# Altium schematic sheet MCU.SchDoc
size A4; SheetNumber: 2; SheetTotal: 14
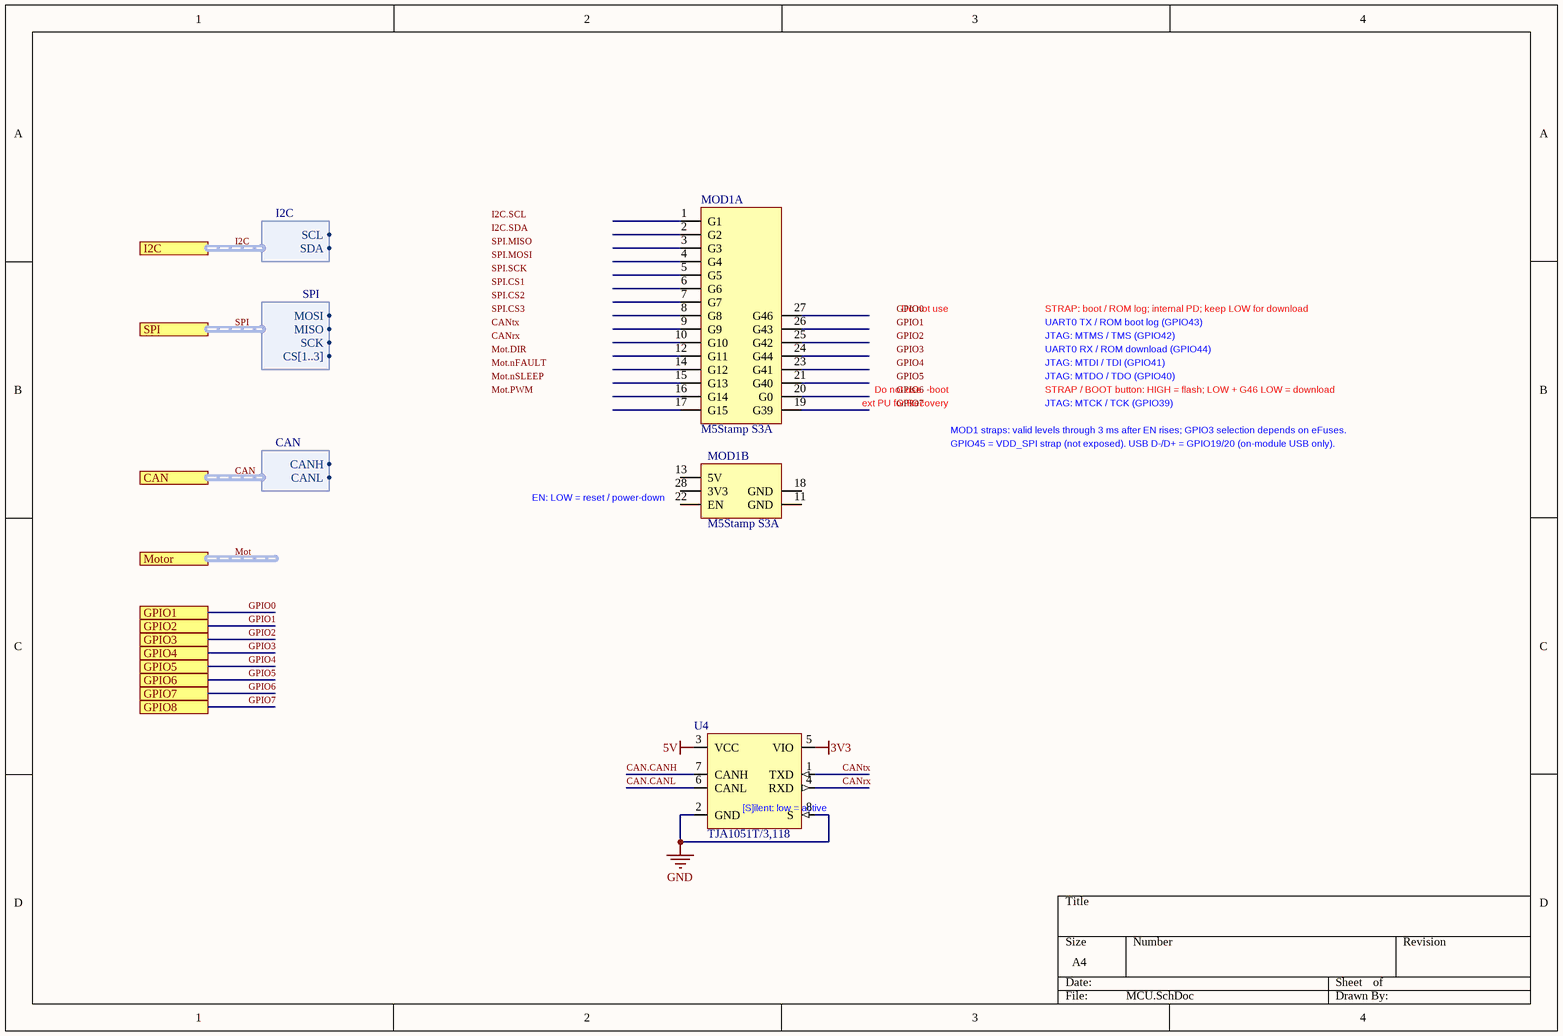
[diagram p0: MCU.SchDoc]

## Parts
MOD1  M5Stamp S3A  [M5Stamp S3A-mfg]  (parts A,B of 2)
U4  TJA1051T/3,118  [NXP-SOIC-8_L]

## Ports
CAN (harness CAN), GPIO1, GPIO2, GPIO3, GPIO4, GPIO5, GPIO6, GPIO7, GPIO8, I2C (harness I2C), Motor (harness MotCtrl), SPI (harness SPI)

## Harnesses
SPI: MOSI, MISO, SCK, CS[1..3]
CAN: CANH, CANL
I2C: SCL, SDA

## Nets
3V3: U4.5(VIO)
5V: U4.3(VCC)
GND: U4.2(GND) U4.8(S)
CAN.CANH: U4.7(CANH)
CAN.CANL: U4.6(CANL)
CANrx: U4.4(RXD)
CANtx: U4.1(TXD)
GPIO0: port GPIO1
GPIO1: port GPIO2
GPIO2: port GPIO3
GPIO3: port GPIO4
GPIO4: port GPIO5
GPIO5: port GPIO6
GPIO6: port GPIO7
GPIO7: port GPIO8

Not connected (* = marked no-connect by the designer): MOD1 1(G1) 2(G2) 3(G3) 4(G4) 5(G5) 6(G6) 7(G7) 8(G8) 9(G9) 10(G10) 11(GND) 12(G11) 13(5V) 14(G12) 15(G13) 16(G14) 17(G15) 18(GND) 19(G39) 20(G0) 21(G40) 22(EN) 23(G41) 24(G44) 25(G42) 26(G43) 27(G46) 28(3V3)

## Buses and harness runs
harness CAN = port CAN
harness I2C = port I2C
harness Mot = port Motor
harness SPI = port SPI

## Notes on the sheet
- Do not use
- STRAP: boot / ROM log; internal PD; keep LOW for download
- JTAG: MTDO / TDO (GPIO40)
- JTAG: MTDI / TDI (GPIO41)
- JTAG: MTMS / TMS (GPIO42)
- UART0 RX / ROM download (GPIO44)
- UART0 TX / ROM boot log (GPIO43)
- Do not use  -boot
- ext PU for Recovery
- MOD1 straps: valid levels through 3 ms after EN rises; GPIO3 selection depends on eFuses.
- GPIO45 = VDD_SPI strap (not exposed). USB D-/D+ = GPIO19/20 (on-module USB only).
- STRAP / BOOT button: HIGH = flash; LOW + G46 LOW = download
- JTAG: MTCK / TCK (GPIO39)
- (near MOD1) EN: LOW = reset / power-down
- (near U4) [S]ilent: low = active
- Labels drawn without touching a wire or pin: CANrx, CANtx, GPIO0, GPIO1, GPIO2, GPIO3, GPIO4, GPIO5, GPIO6, GPIO7, I2C.SCL, I2C.SDA, Mot.DIR, Mot.nFAULT, Mot.nSLEEP, Mot.PWM, SPI.CS1, SPI.CS2, SPI.CS3, SPI.MISO, SPI.MOSI, SPI.SCK

## Library data of the parts
MOD1 = CMP-00060AA.R2: ESP32-S3FN8, 8MB Flash, RGB LED; Processor: ESP32-S3FN8; ComponentLink1Description: Product Page; ComponentLink1URL: https://docs.m5stack.com/en/core/Stamp-S3A
U4 = CMP-031-00023-A02: Interface Circuit, 1-Trnsvr, PDSO8; Data Rate: 1000Mbps; Number of Transceivers: 1; Power Supplies: 5V; Qualification Status: Not Qualified; Max Supply Current: 70uA; Package Body Material: Plastic; Telecom IC Type: CAN TRANSCEIVER; Package Equivalence Code: SOP8,.25; Reach SVHC Compliant: Yes; Width: 3.9mm; Terminal Position: DUAL; Channels: 1; Temperature Grade: AUTOMOTIVE; JESD-30 Code: R-PDSO-G8; Moisture Sensitivity Level: 1; Max Operating Temperature: 125°C; Terminal Pitch: 1.27mm; Case/Package: SOP; Terminal Form: Gull Wing; Pins: 8; Min Operating Temperature: -40°C; Terminal Finish: Nickel; Height - Seated (Max): 1.75mm; Package Style: SMALL OUTLINEMeter; Nominal Supply Voltage: 5V; RoHS Compliant: Yes; Surface Mount: Yes; Package Shape: Rectangular; JESD-609 Code: e4; Length: 4.9mm